# EAGLE design IRDA-piHAT (EAGLE 6.5.0)
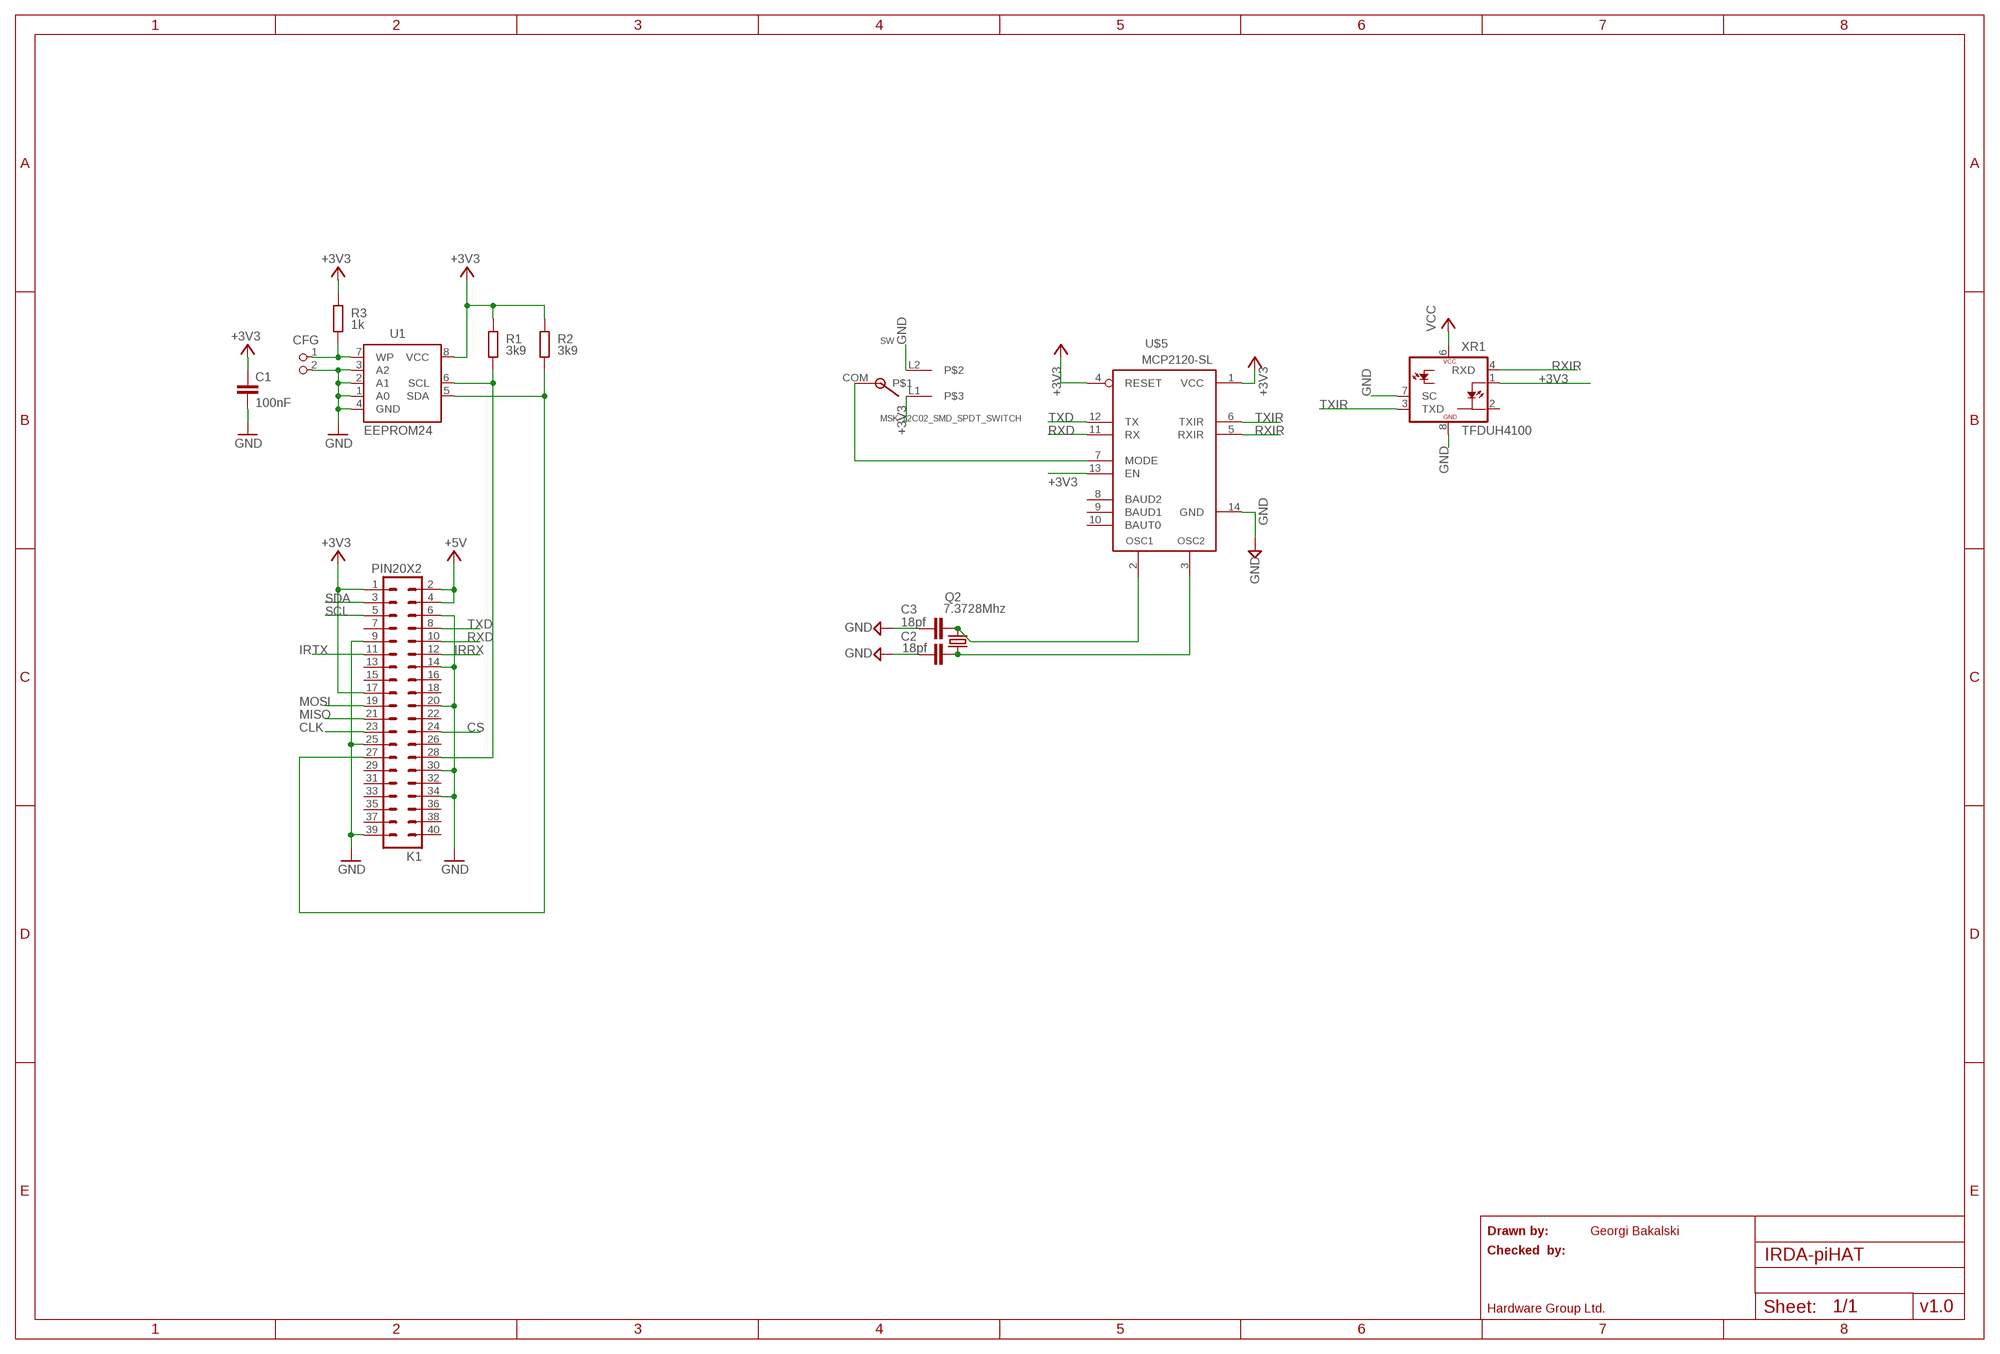
[diagram p0: schematic, sheet 1]

## Parts
C1  100nF  C-EUC0805K  [C0805K]
C2  18pf  CAPC603  [C603]
C3  18pf  CAPC603  [C603]
CFG  PIN2_100  [PIN_W_2]
K1  PIN20X2  [PIN_20X2]
Q2  7.3728Mhz  CRYSTALHC49UP  [HC49UP]
R1  3k9  R-EU_M0805  [M0805]
R2  3k9  R-EU_M0805  [M0805]
R3  1k  R-EU_M0805  [M0805]
SW  MSK-12C02_SMD_SPDT_SWITCH  [MSK-12C02]
U1  EEPROM24  [SOIC8]
U$5  MCP2120-SL  [SO-14]
XR1  TFDUH4100  [TFDU4-HOR]

## Nets
+3V3: C1.1 K1.1 K1.17 R1.2 R2.2 R3.2 SW.L1 U1.8(VCC) U$5.1(VCC) U$5.4(RESET) U$5.13(EN) XR1.1(IRED-A) XR1.6(VCC) ; supply symbol labelled VCC
+5V: K1.2 K1.4
CLK: K1.23
CS: K1.24
GND: C1.2 C2.2 C3.2 CFG.2 K1.6 K1.9 K1.14 K1.20 K1.25 K1.30 K1.34 K1.39 SW.L2 U1.1(A0) U1.2(A1) U1.3(A2) U1.4(GND) U$5.14(GND) XR1.7(SC) XR1.8(GND)
IRRX: K1.12
IRTX: K1.11
MISO: K1.21
MOSI: K1.19
N$3: CFG.1 R3.1 U1.7(WP)
N$4: C3.1 Q2.2 U$5.2(OSC1)
N$5: C2.1 Q2.1 U$5.3(OSC2)
N$10: SW.COM U$5.7(MODE)
N$12: K1.28 R1.1 U1.6(SCL)
N$13: K1.27 R2.1 U1.5(SDA)
RXD: K1.10 U$5.11(RX)
RXIR: U$5.5(RXIR) XR1.4(RXD)
SCL: K1.5
SDA: K1.3
TXD: K1.8 U$5.12(TX)
TXIR: U$5.6(TXIR) XR1.3(TXD)
Unconnected: K1.7 K1.13 K1.15 K1.16 K1.18 K1.22 K1.26 K1.29 K1.31 K1.32 K1.33 K1.35 K1.36 K1.37 K1.38 K1.40 U$5.8(BAUD2) U$5.9(BAUD1) U$5.10(BAUT0) XR1.2(IRED-C)

## Notes on the sheet
- Drawn by: | Georgi Bakalski
- Checked  by:
- Hardware Group Ltd. | v1.0

## Library data of the parts
C1 = resistor:C-EU: CAPACITOR, European symbol; DIELECTRIC: X7R
C2 C3 = dp_devices:CAP
CFG = FLYFISH:PIN2
K1 = FLYFISH:PIN20X2
Q2 = crystal:CRYSTAL: CRYSTAL; OC_FARNELL: unknown; OC_NEWARK: unknown
R1-R3 = resistor:R-EU_: RESISTOR, European symbol; TOLERANCE: 5%
SW = MSK-12C02 SMD Micro Slider Switch SPDT:MSK-12C02_SMD_SPDT_SWITCH: Footprint of the VIMEX MSK-12C02 SPDT SMD Switch Created by mzst on 17-Jan-2016
U1 = FLYFISH:EEPROM24
U$5 = microchip_mcp2120:MCP2120: Infrared Encoder/Decoder
XR1 = opto-vishay:TFD?4100: 2.7 V to 5.5 V Serial Infrared Transceiver Module Family (SIR, 115.2 kbit/s) Vishay Telefunken; MPN: TFDU4101-TT3; OC_FARNELL: 1652525; OC_NEWARK: 27M9702

## Net classes
2 gnd: width 0.305 mm, drill 0.559 mm, clearance 0.254 mm

## Board
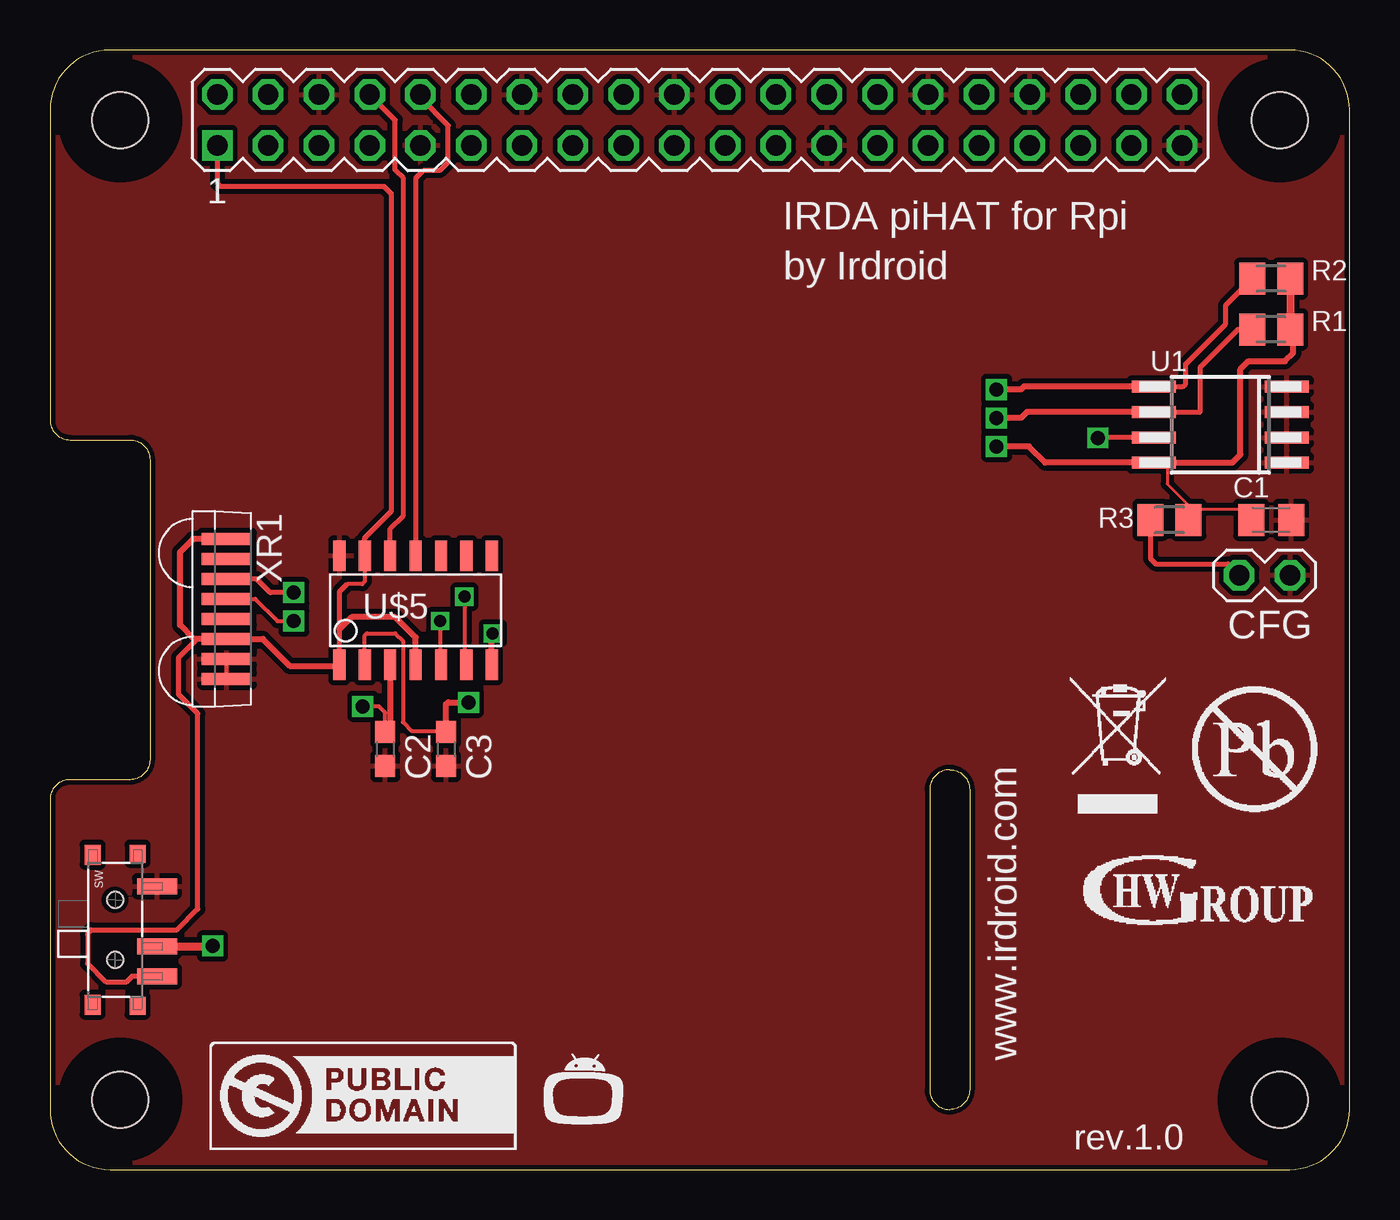
[diagram p1: board, top side]
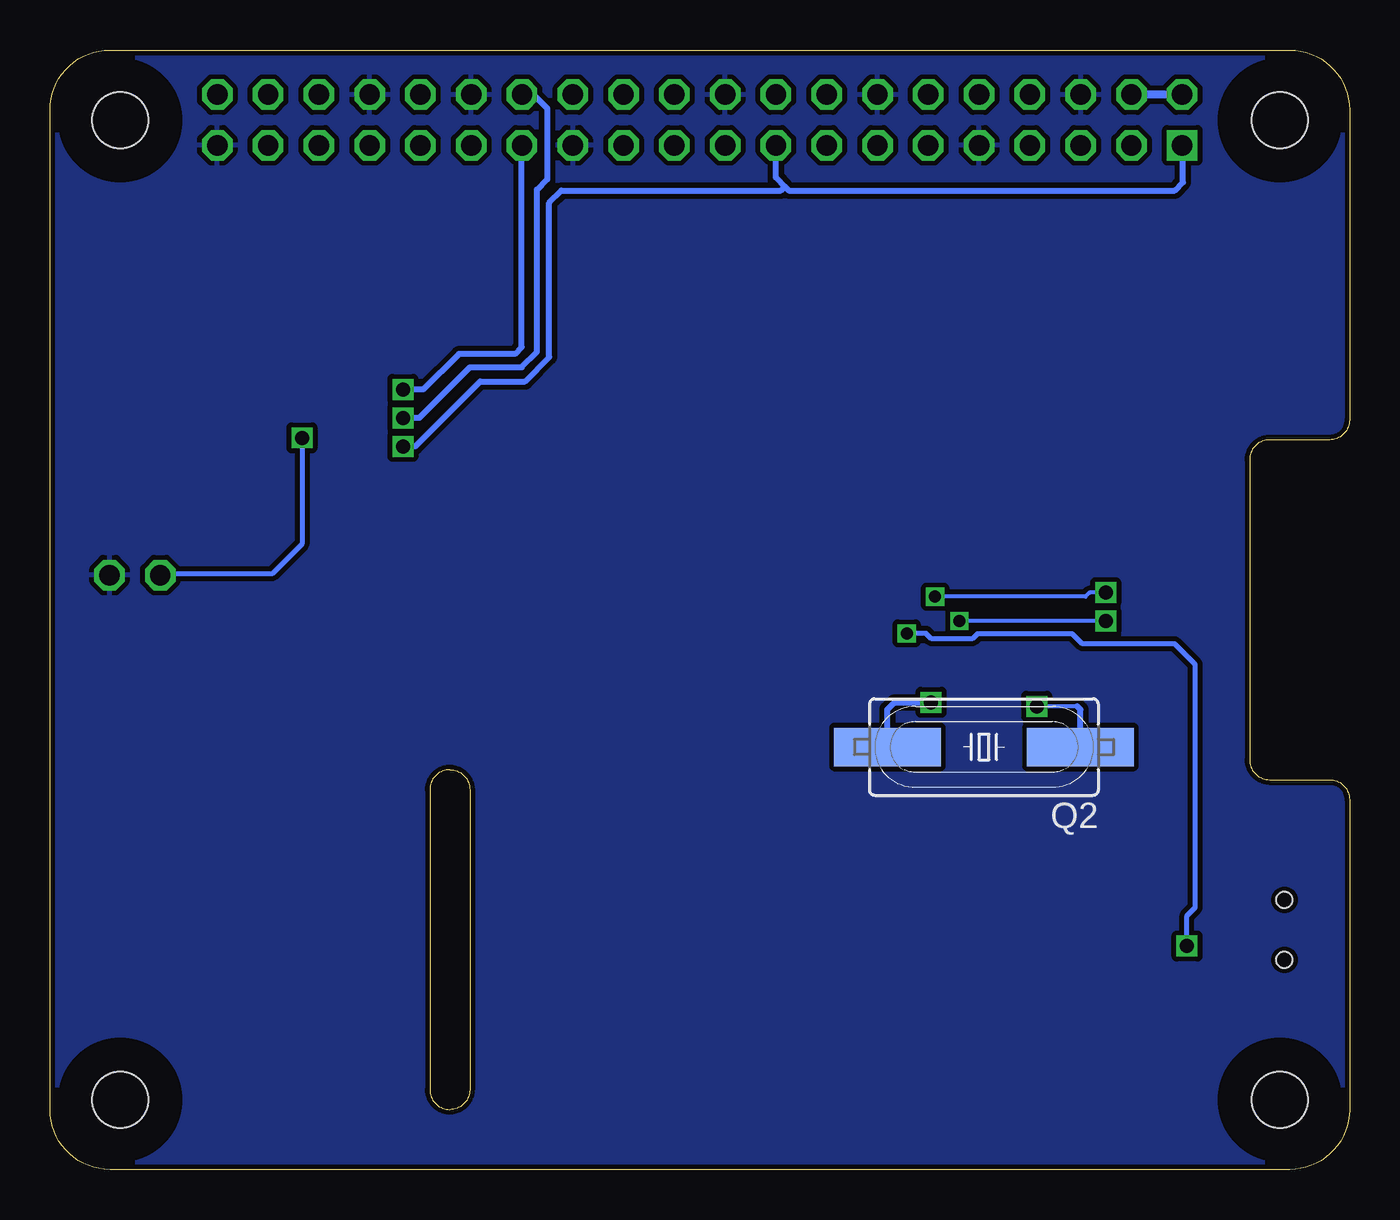
[diagram p2: board, bottom side, seen from below]

Size 65 x 56 mm. Coordinates in mm from the lower left corner, seen from the top.
Outline: 0,3 arc90 3,0 62,0 arc90 65,3 65,53 arc90 62,56 3,56 arc90 0,53 0,37.5 arc90 1,36.5 4,36.5 arc-90 5,35.5 5,20.5 arc-90 4,19.5 1,19.5 arc90 0,18.5 0,3
Outline: 44,19 44,4 arc90 45,3 arc90 46,4 46,19 arc90 45,20 arc90 44,19
Copper layers (1*16): Top 0.035mm / dielectric 1.5mm / Bottom 0.035mm
Design rules "ITEADstudio_DRC *": minimum track width 6mil, minimum drill 12mil, track to track 10mil, track to pad 10mil, pad to pad 10mil, via to via 10mil, smd to smd 0mil, copper to edge 10mil, drill to drill 10mil, minimum pad ring 10mil, minimum via ring 6mil, stop-mask expansion 2mil, vias tented up to drill 100mil, thermal gap 10mil
Holes 2.8 mm at 3.5,3.5 3.5,52.5 61.5,52.5 61.5,3.5
tRestrict: area 1.9,51 to 5,54; area 60,51 to 63,54; area 60,1.9 to 63,5; area 1.9,1.9 to 5,5
bRestrict: area 1.9,1.9 to 5,5; area 1.9,51 to 5,54; area 60,1.9 to 63,5; area 60,51 to 63,54
Milling: 6 lines

### Footprints (pad centres in the part's own frame; a part is rotated, then mirrored left to right if it is on the bottom)
C0805K = smd 1.3 x 1.6: 1 -1,0; 2 1,0
C603 = smd 1.1 x 1: 1 -0.85,0; 2 0.85,0
PIN_W_2 = drill 1.016 octagon: 1 0,0; 2 0,-2.54
PIN_20X2 = drill 1.016 square: 1 -24.13,-1.27 | drill 1.016 octagon: 2 -24.13,1.27; 3 -21.59,-1.27; 4 -21.59,1.27; 5 -19.05,-1.27; 6 -19.05,1.27; 7 -16.51,-1.27; 8 -16.51,1.27; 9 -13.97,-1.27; 10 -13.97,1.27; 11 -11.43,-1.27; 12 -11.43,1.27; 13 -8.89,-1.27; 14 -8.89,1.27; 15 -6.35,-1.27; 16 -6.35,1.27; 17 -3.81,-1.27; 18 -3.81,1.27; 19 -1.27,-1.27; 20 -1.27,1.27; 21 1.27,-1.27; 22 1.27,1.27; 23 3.81,-1.27; 24 3.81,1.27; 25 6.35,-1.27; 26 6.35,1.27; 27 8.89,-1.27; 28 8.89,1.27; 29 11.43,-1.27; 30 11.43,1.27; 31 13.97,-1.27; 32 13.97,1.27; 33 16.51,-1.27; 34 16.51,1.27; 35 19.05,-1.27; 36 19.05,1.27; 37 21.59,-1.27; 38 21.59,1.27; 39 24.13,-1.27; 40 24.13,1.27
HC49UP = smd 5.334 x 1.93: 1 -4.826,0; 2 4.826,0
M0805 = smd 1.3 x 1.6: 1 -0.95,0; 2 0.95,0
MSK-12C02 = smd 0.8 x 2: COM 0.823,2.1; L1 2.323,2.1; L2 -2.177,2.1 | smd 1 x 0.8: GND@1 -3.75,-1.125; GND@4 3.75,-1.125 | smd 0.9 x 0.8: GND@2 -3.8,1.125; GND@3 3.8,1.125 | hole 0.8: -1.5,0; 1.5,0
SOIC8 = smd 0.6 x 2.2: 1 -1.905,-3.33; 2 -0.635,-3.33; 3 0.635,-3.33; 4 1.905,-3.33; 5 1.905,3.33; 6 0.635,3.33; 7 -0.635,3.33; 8 -1.905,3.33
SO-14 = smd 0.61 x 1.524: 1 -3.81,-2.794; 2 -2.54,-2.794; 3 -1.27,-2.794; 4 0,-2.794; 5 1.27,-2.794; 6 2.54,-2.794; 7 3.81,-2.794; 8 3.81,2.667; 9 2.54,2.667; 10 1.27,2.667; 11 0,2.667; 12 -1.27,2.667; 13 -2.54,2.667; 14 -3.81,2.667
TFDU4-HOR = smd 0.6 x 2.5: 1 -3.5,0; 2 -2.5,0; 3 -1.5,0; 4 -0.5,0; 5 0.5,0; 6 1.5,0; 7 2.5,0; 8 3.5,0

### Placement (x,y rotation side)
C1  61.08,32.5 0 top
C2  16.76,21.03 270 top
C3  19.81,21.03 270 top
CFG  59.48,29.73 90 top
K1  32.5,52.5 0 top
Q2  18.29,21.13 180 bottom
R1  61.08,42.02 0 top
R2  61.08,44.56 0 top
R3  55.99,32.5 0 top
SW  3.25,11.99 270 top
U1  58.53,37.26 90 top
U$1  [LOGO_CC-0]  8,1 0 top
U$2  [IRDROIDLOGO]  24.4,2 0 top
U$3  [TRASH]  51.4,17.79 0 top
U$4  [HWGROUP]  51.41,11.79 0 top
U$5  18.29,28.04 0 top
XR1  8.84,28.04 270 top

### Tracks (layer width: path | path; a pad name or v marks a point on that pad's centre or on a via)
+3V3  (via drill 0.7)
  Top 0.152: 57.15,33.02 59.69,33.02 C1.1 | 57.15,33.02 55.88,34.29 55.88,35.56 U1.8 | 57.15,33.02 R3.2
  Top 0.203: 15.65,30.61 15.65,30.15 15.75,30.05 15.75,29.41 15.62,29.29 14.86,29.29 14.83,29.26
  Top 0.254: U$5.1 14.48,27.03 14.48,28.91 14.83,29.26 | 15.65,30.61 U$5.13 15.75,31.6 17.07,32.92 17.07,48.82 16.71,49.17 8.53,49.17 8.38,49.33 8.38,51.22 K1.1 | SW.L1 4.1,9.67 3.81,9.37 2.82,9.37 1.88,10.31 1.88,11.76 1.91,11.76 1.91,11.84 2.06,11.99 6.35,11.99 7.39,13.03 7.39,22.81 6.43,23.77 6.43,25.6 7.37,26.54
  Top 0.305: R1.2 62.18,41.87 62.18,40.84 61.77,40.44 59.94,40.44 59.54,40.03 59.54,35.76 59.13,35.35 U1.8 49.79,35.35 48.97,36.17 v47.35,36.17 | U$5.4 18.29,26.62 17.27,27.64 15.09,27.64 14.48,27.03 | U$5.1 14.43,25.2 11.99,25.2 10.64,26.54 XR1.6 7.37,26.54 7.19,26.54 6.5,27.23 6.5,30.89 7.16,31.54 XR1.1
  Top 0.406: R2.2 R1.2
  Bottom 0.305: 28.25,49.17 28.7,49.63 K1.17 | 28.25,49.17 28.04,48.97 8.74,48.97 8.33,49.38 8.33,51.19 K1.1 | 28.25,49.17 28.45,48.97 39.42,48.97 40.03,48.36 40.03,40.64 41.25,39.42 43.48,39.42 46.74,36.17 v47.35,36.17
+5V
  Bottom 0.406: K1.2 K1.4
GND
  Top 0.203: XR1.8 XR1.7
  pour Bottom: 0,3 arc90 3,0 62,0 arc90 65,3 65,53 arc90 62,56 3,56 arc90 0,53 0,37.5 arc90 1,36.5 4,36.5 arc-90 5,35.5 5,20.5 arc-90 4,19.5 1,19.5 arc90 0,18.5
  pour Top: 0,3 arc90 3,0 62,0 arc90 65,3 65,53 arc90 62,56 3,56 arc90 0,53 0,37.5 arc90 1,36.5 4,36.5 arc-90 5,35.5 5,20.5 arc-90 4,19.5 1,19.5 arc90 0,18.5
N$3  (via drill 0.7)
  Top 0.254: U1.7 52.42,36.62 v52.4,36.6 | R3.1 55.05,30.55 55.3,30.3 58.91,30.3 CFG.1
  Bottom 0.254: v52.4,36.6 52.4,31.3 53.9,29.8 59.41,29.8 CFG.1
N$4  (via drill 0.7)
  Top 0.203: U$5.2 15.75,26.72 15.85,26.82 17.27,26.82 17.65,26.44 17.65,22.38 18.09,21.95 19.75,21.95 C3.1
  Top 0.305: C3.1 19.81,23.27 19.91,23.37 v20.93,23.37
  Bottom 0.305: Q2.2 23.11,23.01 22.76,23.37 v20.93,23.37
N$5  (via drill 0.7)
  Top 0.203: C2.1 16.76,22.86 16.46,23.16 v15.65,23.16
  Top 0.305: U$5.3 17.02,22.14 C2.1
  Bottom 0.203: 13.61,23.16 v15.65,23.16
  Bottom 0.305: Q2.1 13.46,23.01 13.61,23.16
N$10  (via drill 0.6, 0.7)
  Top 0.305: U$5.7 22.1,26.77 v22.15,26.82
  Top 0.406: SW.COM 8.13,11.17 v8.13,11.18
  Bottom 0.254: v22.15,26.82 21.18,26.82 20.9,26.54 18.87,26.54 18.62,26.8 13.87,26.8 13.36,26.29 8.74,26.29 7.72,25.27 7.72,13.11 8.13,12.7 v8.13,11.18
N$12  (via drill 0.7)
  Top 0.254: U1.6 57.53,37.9 57.53,40.13 59.44,42.04 60.11,42.04 R1.1
  Top 0.305: U1.6 48.87,37.9 48.56,37.59 v47.35,37.59
  Bottom 0.305: K1.28 40.82,53.77 40.13,53.09 40.13,49.53 40.64,49.02 40.64,40.89 41.4,40.13 43.99,40.13 46.53,37.59 v47.35,37.59
N$13  (via drill 0.7)
  Top 0.254: U1.5 56.66,39.16 56.8,39.3 56.8,40.3 58.8,42.3 58.8,43.24 R2.1
  Top 0.305: U1.5 48.72,39.16 48.56,39.01 v47.35,39.01
  Bottom 0.305: K1.27 41.4,51.22 41.4,41.15 41.75,40.8 44.54,40.8 46.33,39.01 v47.35,39.01
RXD
  Top 0.254: K1.10 18.53,53.61 19.91,52.22 19.91,50.39 19.51,49.99 18.69,49.99 18.29,49.58 U$5.11
RXIR  (via drill 0.6, 0.7)
  Top 0.203: XR1.4 10.27,28.54 11.38,27.43 v12.19,27.43 | v19.51,27.43 19.51,25.3 U$5.5
  Bottom 0.203: v12.19,27.43 v19.51,27.43
TXD
  Top 0.254: U$5.12 17.02,32.05 17.68,32.72 17.68,49.58 17.27,49.99 17.27,52.49 K1.8
TXIR  (via drill 0.6, 0.7)
  Top 0.203: v20.73,28.65 20.73,25.35 U$5.6
  Top 0.254: v12.19,28.85 11.02,28.85 10.34,29.54 XR1.3
  Bottom 0.203: v12.19,28.85 13.01,28.85 13.21,28.65 v20.73,28.65

### Text on the board
tNames: IRDA piHAT for Rpi | by Irdroid | www.irdroid.com | rev.1.0